# Altium schematic sheet 05_ElectronicScales.SchDoc
size A4
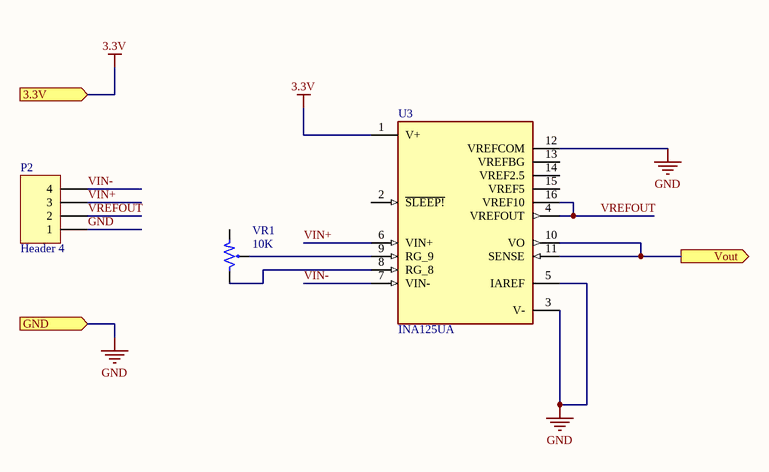
[diagram p0: 05_ElectronicScales.SchDoc]

## Parts
P2  Header 4  [HDR1X4]
U3  INA125UA  [SOIC127P600X175-16N]
VR1  10K  [VR]

## Ports
3.3V (in), GND (in), Vout (out)

## Nets
3.3V: U3.1(V+) ; port 3.3V
GND: P2.1 U3.3(V-) U3.5(IAREF) U3.12(VREFCOM) ; port GND
VIN+: P2.3 U3.6(VIN+)
VIN-: P2.4 U3.7(VIN-)
Vout: U3.10(VO) U3.11(SENSE) ; port Vout
VREFOUT: P2.2 U3.4(VREFOUT) U3.16(VREF10)
NetU3_8: U3.8(RG_8) VR1.3
NetU3_9: U3.9(RG_9) VR1.2

Not connected (* = marked no-connect by the designer): U3 2(~{SLEEP!}) 13(VREFBG) 14(VREF2.5) 15(VREF5); VR1 1

## Notes on the sheet
- Project:
- MANDevices
- Page Contents:
- Size:
- Date:
- A4
- Checked by:
- Time:
- Revision:
- Sheet
- of
- HaNoi University of
- Science and Technology
- File:

## Library data of the parts
P2 = Header 4: Header, 4-Pin; LatestRevisionDate: 17-Jul-2002; LatestRevisionNote: Re-released for DXP Platform.; Publisher: Altium Limited
U3 = INA125UA: Instrumentation Amplifier with Precision Voltage Reference 16-SOIC; Price: None; MP: INA125UA; Value: *; Availability: Unavailable; Package: None
VR1 = VR1: Var Resistor; Value: VR 10K